# Altium schematic sheet Power.SchDoc
size A4; SheetNumber: 6; SheetTotal: 6
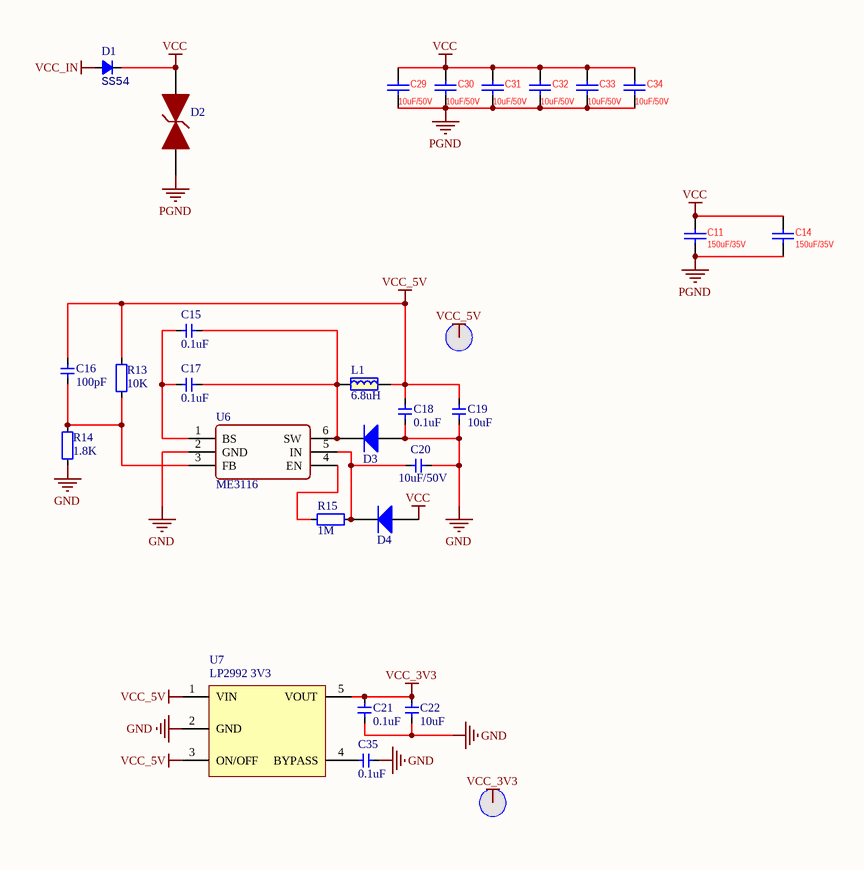
[diagram p0: Power.SchDoc]

## Parts
C11  value 150uF/35V  [CAP-SMD_BD8.0-L8.3-W8.3-LS9.3-FD]  (hidden comment: 220uF/25V)
C14  value 150uF/35V  [CAP-SMD_BD8.0-L8.3-W8.3-LS9.3-FD]  (hidden comment: 220uF/25V)
C15  0.1uF  [CAP_0402]
C16  100pF  [CAP_0402]
C17  0.1uF  [CAP_0402]
C18  0.1uF  [CAP_0402]
C19  10uF  [CAP_0402]
C20  10uF/50V  [1206-CAP]
C21  0.1uF  [CAP_0402]
C22  10uF  [CAP_0402]
C29  10uF/50V  [1206-CAP]
C30  10uF/50V  [1206-CAP]
C31  10uF/50V  [1206-CAP]
C32  10uF/50V  [1206-CAP]
C33  10uF/50V  [1206-CAP]
C34  10uF/50V  [1206-CAP]
C35  0.1uF  [CAP_0402]
D1  SS54  [DO-214AC]
D2  SMBJ28CA  [SMBJ-CA_MFG]  (value not drawn)
D3  二极管-5819W  [SOD-323]  (value not drawn)
D4  二极管-5819W  [SOD-323]  (value not drawn)
L1  6.8uH  [IND-201612]
R13  10K  [RES_0402]
R14  1.8K  [RES_0402]
R15  1M  [RES_0402]
T1  测试点  [TEST_PT]  (value not drawn)
T2  测试点  [TEST_PT]  (value not drawn)
U6  ME3116  [SOT23-6]
U7  LP2992 3V3  [SOT23-5]

## Nets
GND: C18.1 C19.1 C20.1 C21.1 C22.1 C35.1 D3.1(A) R14.1 U6.2(GND) U7.2(GND)
PGND: C11.2 C14.2 C29.2 C30.2 C31.2 C32.2 C33.2 C34.2 D2.1
VCC: C11.1 C14.1 C29.1 C30.1 C31.1 C32.1 C33.1 C34.1 D1.2(K) D2.2 D4.1(A)
VCC_3V3: C21.2 C22.2 T2.0 U7.5(VOUT)
VCC_5V: C16.1 C18.2 C19.2 L1.2 R13.2 T1.0 U7.1(VIN) U7.3(ON/OFF)
VCC_IN: D1.1(A)
NetC15_1: C15.1 C17.1 D3.2(K) L1.1 U6.6(SW)
NetC15_2: C15.2 C17.2 U6.1(BS)
NetC16_2: C16.2 R13.1 R14.2 U6.3(FB)
NetC20_2: C20.2 D4.2(K) R15.1 U6.5(IN)
NetC35_2: C35.2 U7.4(BYPASS)
NetR15_2: R15.2 U6.4(EN)

## Library data of the parts
C11 C14 C29-C34 = CAP: Capacitor, chip, ceramic; Parameters: E22 CAP; PN: RVT1E221M0607; Price: 0.038
  C29-C34: Value: 10uF/50V
C15-C22 C35 = 电容-0402: Capacitor; Value: 0.1u
D1 = Diode_SMA: Diode; Type: SMA; Value: SS54
D3 D4 = 二极管-5819W: 40V
L1 = 电感-201612
R13-R15 = 电阻-0402: Resistor; Value: 22R
U6 = ME3116: DC-DC
U7 = LP2992: LDO